# EAGLE design pots-board (EAGLE 6.6.0)
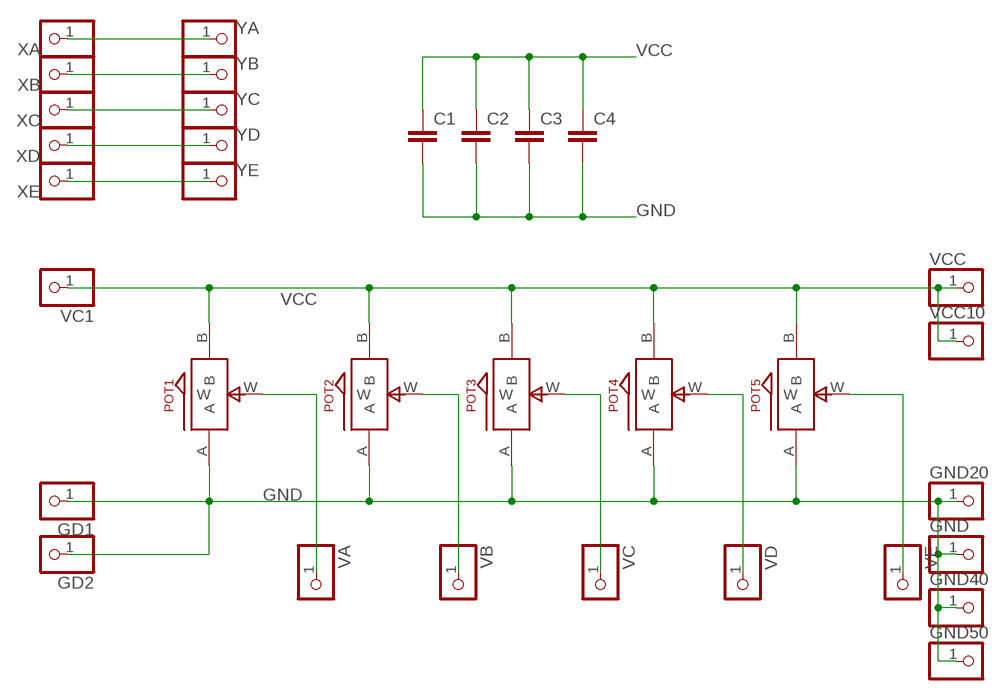
[diagram p0: schematic, sheet 1]

## Parts
C1  C-EUC0805  [C0805]
C2  C-EUC0805  [C0805]
C3  C-EUC0805  [C0805]
C4  C-EUC0805  [C0805]
GD1  PINHD-1X1  [1X01]
GD2  PINHD-1X1  [1X01]
GND  PINHD-1X1  [1X01]
GND20  PINHD-1X1  [1X01]
GND40  PINHD-1X1  [1X01]
GND50  PINHD-1X1  [1X01]
POT1  ALPS_POT_SMALL  [SMALL_ALPS_POT]
POT2  ALPS_POT_SMALL  [SMALL_ALPS_POT]
POT3  ALPS_POT_SMALL  [SMALL_ALPS_POT]
POT4  ALPS_POT_SMALL  [SMALL_ALPS_POT]
POT5  ALPS_POT_SMALL  [SMALL_ALPS_POT]
VA  PINHD-1X1  [1X01]
VB  PINHD-1X1  [1X01]
VC  PINHD-1X1  [1X01]
VC1  PINHD-1X1  [1X01]
VCC  PINHD-1X1  [1X01]
VCC10  PINHD-1X1  [1X01]
VD  PINHD-1X1  [1X01]
VE  PINHD-1X1  [1X01]
XA  PINHD-1X1  [1X01]
XB  PINHD-1X1  [1X01]
XC  PINHD-1X1  [1X01]
XD  PINHD-1X1  [1X01]
XE  PINHD-1X1  [1X01]
YA  PINHD-1X1  [1X01]
YB  PINHD-1X1  [1X01]
YC  PINHD-1X1  [1X01]
YD  PINHD-1X1  [1X01]
YE  PINHD-1X1  [1X01]

## Nets
GND: C1.2 C2.2 C3.2 C4.2 GD1.1 GD2.1 GND20.1 GND40.1 GND50.1 GND.1 POT1.A POT2.A POT3.A POT4.A POT5.A
N$3: POT1.W VA.1
N$4: POT2.W VB.1
N$5: POT3.W VC.1
N$6: POT4.W VD.1
N$7: POT5.W VE.1
N$8: XA.1 YA.1
N$9: XB.1 YB.1
N$10: XC.1 YC.1
N$11: XD.1 YD.1
N$12: XE.1 YE.1
VCC: C1.1 C2.1 C3.1 C4.1 POT1.B POT2.B POT3.B POT4.B POT5.B VC1.1 VCC10.1 VCC.1

## Library data of the parts
C1-C4 = rcl:C-EU: CAPACITOR, European symbol
GD1 GD2 GND GND20 GND40 GND50 VA VB VC VC1 VCC VCC10 VD VE XA XB XC XD XE YA YB YC YD YE = pinhead:PINHD-1X1: PIN HEADER
POT1-POT5 = jasons_stuff:ALPS_POT_SMALL

## Board
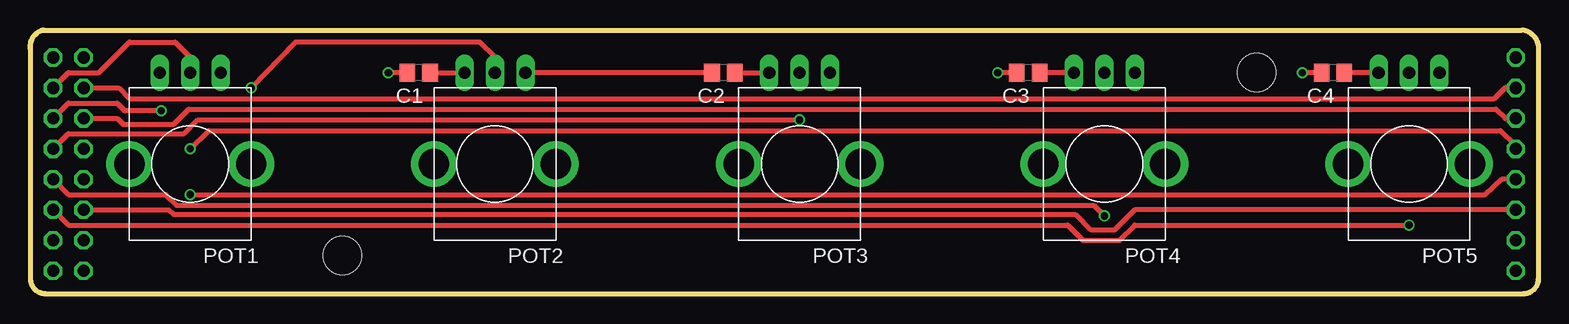
[diagram p1: board, top side]
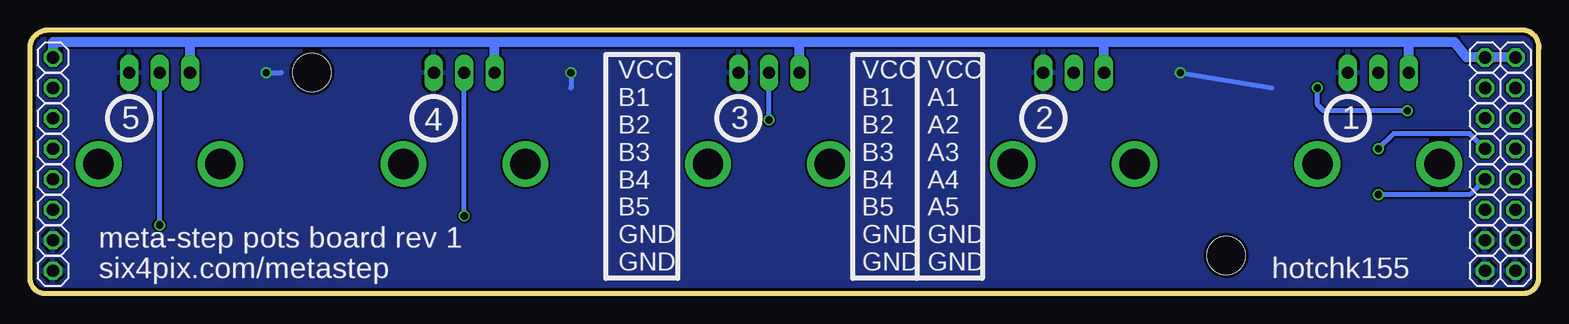
[diagram p2: board, bottom side, seen from below]

Size 125.76 x 21.97 mm. Coordinates in mm from the lower left corner, seen from the top.
Outline: 1.17,21.97 124.36,21.97 arc-90 125.75,20.32 125.75,1.27 arc-90 124.48,0 1.29,0 arc-90 0.02,1.27 0.02,20.32 arc-90 1.17,21.97
Copper layers (1*16): Top 0.035mm / dielectric 1.5mm / Bottom 0.035mm
Design rules "ITEADstudio_DRC": minimum track width 6mil, minimum drill 12mil, track to track 6mil, track to pad 6mil, pad to pad 6mil, via to via 6mil, smd to smd 0mil, copper to edge 10mil, drill to drill 10mil, minimum pad ring 10mil, minimum via ring 6mil, stop-mask expansion 2mil, vias tented up to drill 100mil, thermal gap 10mil
Holes 3.2 mm at 26.06,3.17 102.26,18.41

### Footprints (pad centres in the part's own frame; a part is rotated, then mirrored left to right if it is on the bottom)
C0805 = smd 1.3 x 1.5: 1 -0.95,0; 2 0.95,0
1X01 = drill 1.016 octagon: 1 0,0
SMALL_ALPS_POT = drill 1.016 long: A -2.54,-7.62; B 2.54,-7.62; W 0,-7.62 | drill 2.54 pad 3.81: GND@1 -5.08,0; GND@2 5.08,0

### Placement (x,y rotation side)
C1  32.41,18.41 180 top
C2  57.81,18.41 180 top
C3  83.21,18.41 180 top
C4  108.61,18.41 180 top
GD1  4.47,4.44 0 bottom
GD2  4.47,1.91 0 bottom
GND  1.93,1.91 0 bottom
GND20  123.85,4.44 0 bottom
GND40  1.93,4.44 0 bottom
GND50  123.85,1.91 0 bottom
POT1  13.36,10.79 180 top
POT2  38.76,10.79 180 top
POT3  64.16,10.79 180 top
POT4  89.56,10.79 180 top
POT5  114.96,10.79 180 top
VA  1.93,17.14 0 bottom
VB  1.93,14.61 0 bottom
VC  1.93,12.07 0 bottom
VC1  4.47,19.68 0 bottom
VCC  1.93,19.68 0 bottom
VCC10  123.85,19.68 0 bottom
VD  1.93,9.53 0 bottom
VE  1.93,6.99 0 bottom
XA  4.47,17.14 0 bottom
XB  4.47,14.61 0 bottom
XC  4.47,12.07 0 bottom
XD  4.47,9.53 0 bottom
XE  4.47,6.99 0 bottom
YA  123.85,17.14 0 bottom
YB  123.85,14.61 0 bottom
YC  123.85,12.07 0 bottom
YD  123.85,9.53 0 bottom
YE  123.85,6.99 0 bottom

### Tracks (layer width: path | path; a pad name or v marks a point on that pad's centre or on a via)
GND  (via drill 0.6)
  Top 0.406: C1.2 v29.87,18.41 | C4.2 v106.07,18.41 | C3.2 v80.67,18.41 | C2.2 POT2.A
  Bottom 0.406: v29.87,18.41 22.25,17.14 | v106.07,18.41 104.8,18.41 | v80.67,18.41 80.67,17.14
  pour Bottom: -3.15,23.49 -3.15,-1.91 130.2,-1.91 130.2,23.49
N$3
  Top 0.406: VA.1 3.2,18.41 5.74,18.41 8.28,20.95 12.09,20.95 13.36,19.68 POT1.W
N$4  (via drill 0.6)
  Top 0.406: VB.1 3.2,15.88 7.26,15.88 7.9,15.24 v10.94,15.24 | POT2.W 38.76,19.68 37.49,20.95 22.12,20.95 v18.44,17.14
  Bottom 0.406: v10.94,15.24 17.93,15.24 18.44,15.75 v18.44,17.14
N$5  (via drill 0.6)
  Top 0.406: VC.1 3.2,13.34 12.85,13.34 13.99,14.48 v64.16,14.48
  Bottom 0.406: v64.16,14.48 POT3.W
N$6  (via drill 0.6)
  Top 0.406: VD.1 3.2,8.26 11.33,8.26 12.21,7.37 88.67,7.37 v89.56,6.48
  Bottom 0.406: v89.56,6.48 POT4.W
N$7  (via drill 0.6)
  Top 0.406: VE.1 3.2,5.71 86.51,5.71 87.78,4.44 90.83,4.44 92.1,5.71 v114.96,5.71
  Bottom 0.406: v114.96,5.71 POT5.W
N$8
  Top 0.406: XA.1 7.39,17.14 8.28,16.26 122.07,16.26 122.96,17.14 YA.1
N$9
  Top 0.406: XB.1 7.26,14.61 7.77,14.1 11.96,14.1 13.23,15.37 122.2,15.37 122.96,14.61 YB.1
N$10  (via drill 0.6)
  Top 0.406: v13.36,12.07 14.88,13.59 122.58,13.59 123.85,12.32 YC.1
  Bottom 0.406: XC.1 5.74,13.34 12.09,13.34 v13.36,12.07
N$11  (via drill 0.6)
  Top 0.406: v13.36,8.26 121.31,8.26 122.7,9.53 YD.1
  Bottom 0.406: XD.1 5.74,8.26 v13.36,8.26
N$12
  Top 0.406: YE.1 92.1,6.99 90.45,5.33 88.41,5.33 87.14,6.6 11.96,6.6 11.58,6.99 XE.1
VCC
  Top 0.406: C2.1 POT3.B | C1.1 POT2.B | POT4.B C3.1 | POT5.B C4.1
  Bottom 0.813: VCC.1 VC1.1 5.99,19.68 7.01,20.95 10.82,20.95 | 10.82,20.95 36.22,20.95 | 36.22,20.95 61.62,20.95 | 61.62,20.95 87.02,20.95 | 87.02,20.95 112.42,20.95 | 112.42,20.95 123.85,20.95 VCC10.1 | POT1.B 10.82,20.95 | POT2.B 36.22,20.95 | POT3.B 61.62,20.95 | POT4.B 87.02,20.95 | POT5.B 112.42,20.95

### Text on the board
bPlace: 1 | 2 | 3 | 5 | 4
bNames: meta-step pots board rev 1 | VCC / A1 / A2 / A3 / A4 / A5 / GND / GND | VCC / B1 / B2 / B3 / B4 / B5 / GND / GND | VCC / B1 / B2 / B3 / B4 / B5 / GND / GND | hotchk155 | six4pix.com/metastep